# Altium schematic sheet Sensor.SchDoc
size A4
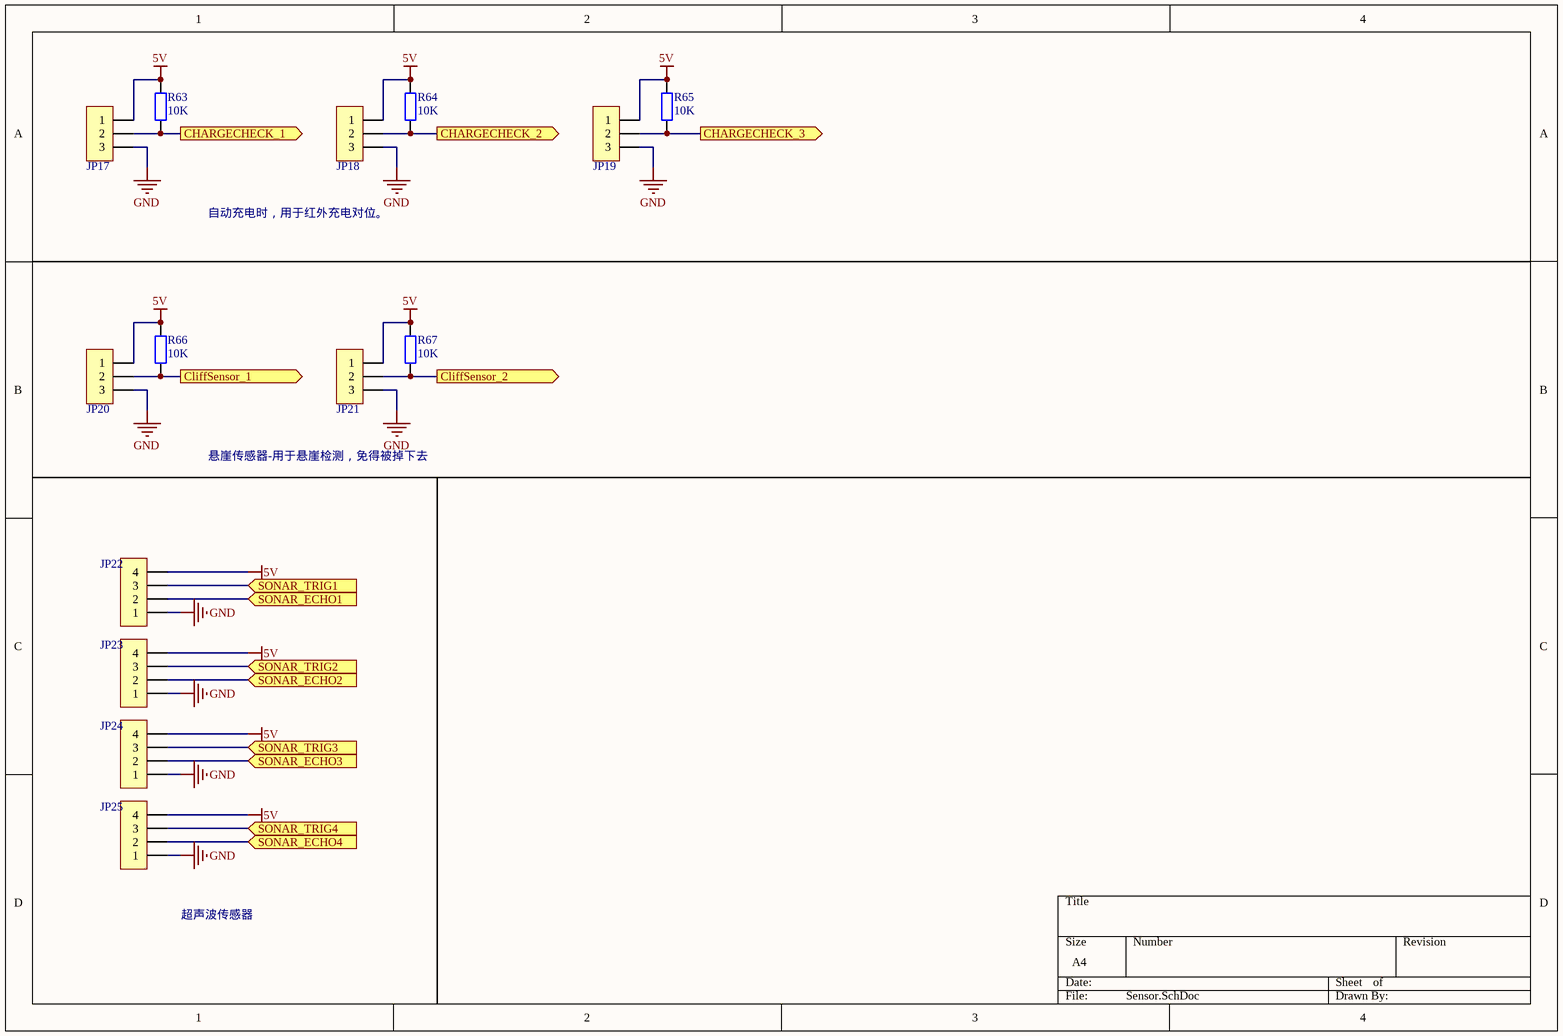
[diagram p0: Sensor.SchDoc]

## Parts
JP17  HDR-1X3  [XH2.54-LI-3P]  (value not drawn)
JP18  HDR-1X3  [XH2.54-LI-3P]  (value not drawn)
JP19  HDR-1X3  [XH2.54-LI-3P]  (value not drawn)
JP20  HDR-1X3  [XH2.54-LI-3P]  (value not drawn)
JP21  HDR-1X3  [XH2.54-LI-3P]  (value not drawn)
JP22  HDR-1X4  [XH2.54-LI-4P]  (value not drawn)
JP23  HDR-1X4  [XH2.54-LI-4P]  (value not drawn)
JP24  HDR-1X4  [XH2.54-LI-4P]  (value not drawn)
JP25  HDR-1X4  [XH2.54-LI-4P]  (value not drawn)
R63  10K  [R 0603_M]
R64  10K  [R 0603_M]
R65  10K  [R 0603_M]
R66  10K  [R 0603_M]
R67  10K  [R 0603_M]

## Ports
CHARGECHECK_1 (out), CHARGECHECK_2 (out), CHARGECHECK_3 (out), CliffSensor_1 (out), CliffSensor_2 (out), SONAR_ECHO1 (in), SONAR_ECHO2 (in), SONAR_ECHO3 (in), SONAR_ECHO4 (in), SONAR_TRIG1 (in), SONAR_TRIG2 (in), SONAR_TRIG3 (in), SONAR_TRIG4 (in)

## Nets
5V: JP17.1 JP18.1 JP19.1 JP20.1 JP21.1 JP22.4 JP23.4 JP24.4 JP25.4 R63.2 R64.2 R65.2 R66.2 R67.2
GND: JP17.3 JP18.3 JP19.3 JP20.3 JP21.3 JP22.1 JP23.1 JP24.1 JP25.1
CHARGECHECK_1: JP17.2 R63.1 ; port CHARGECHECK_1
CHARGECHECK_2: JP18.2 R64.1 ; port CHARGECHECK_2
CHARGECHECK_3: JP19.2 R65.1 ; port CHARGECHECK_3
CliffSensor_1: JP20.2 R66.1 ; port CliffSensor_1
CliffSensor_2: JP21.2 R67.1 ; port CliffSensor_2
SONAR_ECHO1: JP22.2 ; port SONAR_ECHO1
SONAR_ECHO2: JP23.2 ; port SONAR_ECHO2
SONAR_ECHO3: JP24.2 ; port SONAR_ECHO3
SONAR_ECHO4: JP25.2 ; port SONAR_ECHO4
SONAR_TRIG1: JP22.3 ; port SONAR_TRIG1
SONAR_TRIG2: JP23.3 ; port SONAR_TRIG2
SONAR_TRIG3: JP24.3 ; port SONAR_TRIG3
SONAR_TRIG4: JP25.3 ; port SONAR_TRIG4

## Notes on the sheet
- 自动充电时，用于红外充电对位。
- 悬崖传感器-用于悬崖检测，免得被掉下去
- 超声波传感器

## Library data of the parts
JP17-JP21 = Header 3: 3P接插件; 版权归属: 源创客; BOM名称: 3P接插件; 学习资源: www.ooocke.com
JP22-JP25 = Header 4: 4P接插件; 版权归属: 源创客; BOM名称: 4P接插件; 学习资源: www.ooocke.com
R63-R67 = R: 贴片电阻; 版权归属: 源创客; BOM名称: 贴片电阻; 学习资源: www.ooocke.com